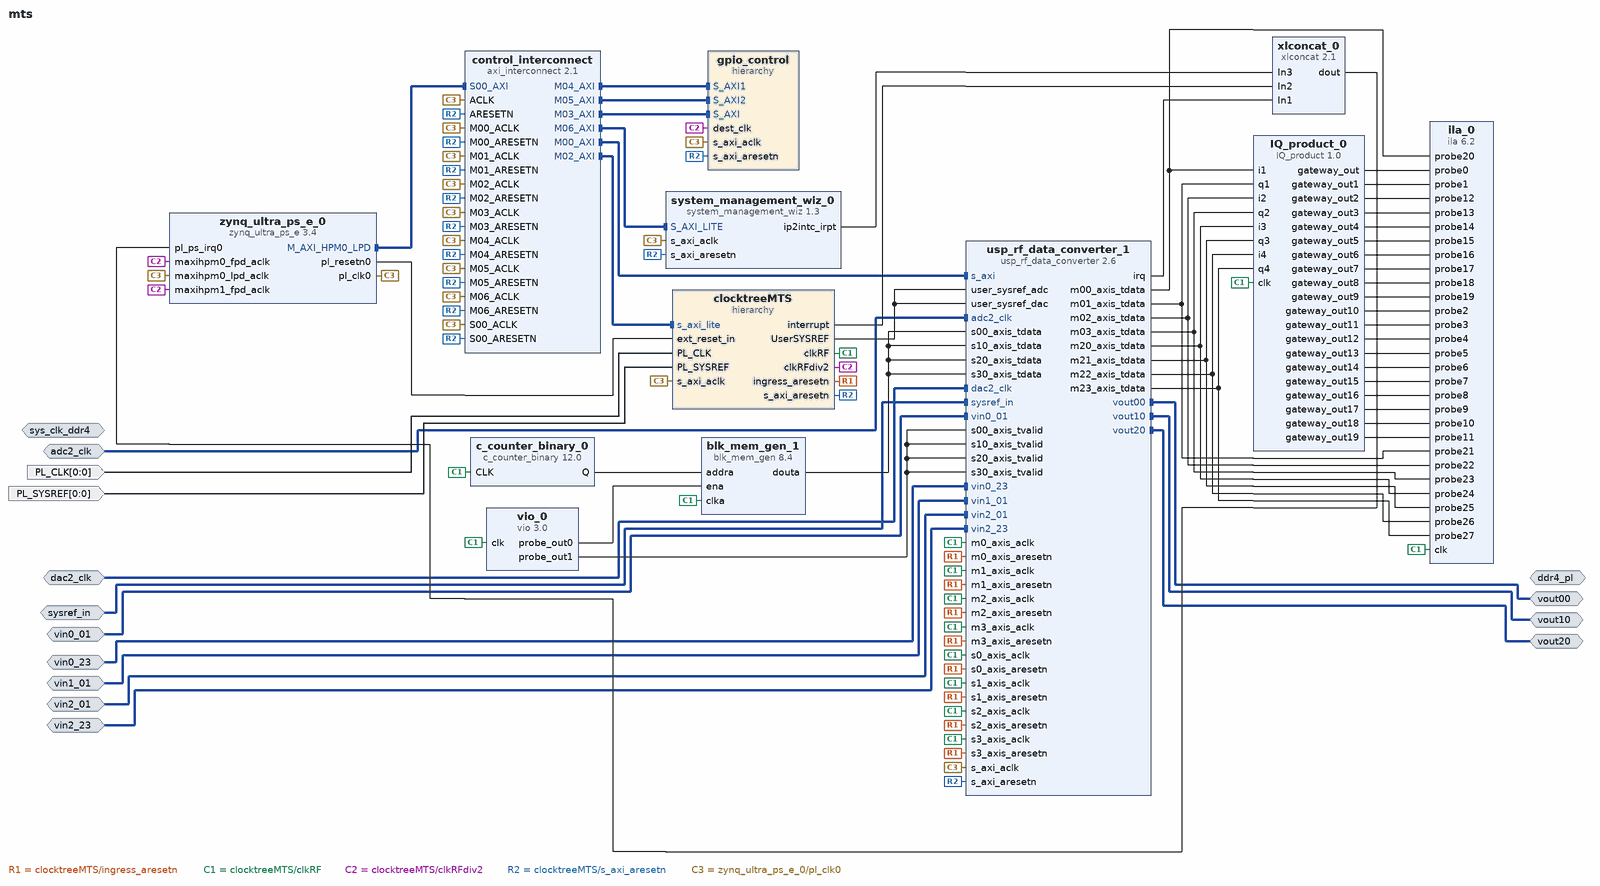
[diagram p0: block diagram of the top level]
# Vivado block design mts, xczu48dr-ffvg1517-2-e, Vivado 2022.2.2
create_bd_design mts

create_bd_intf_port -mode Slave -vlnv xilinx.com:interface:diff_clock_rtl:1.0 adc2_clk
create_bd_intf_port -mode Slave -vlnv xilinx.com:interface:diff_clock_rtl:1.0 dac2_clk
create_bd_intf_port -mode Master -vlnv xilinx.com:interface:ddr4_rtl:1.0 ddr4_pl
create_bd_intf_port -mode Slave -vlnv xilinx.com:interface:diff_clock_rtl:1.0 sys_clk_ddr4
set_property -dict {CONFIG.FREQ_HZ 200000000} [get_bd_intf_ports sys_clk_ddr4]
create_bd_intf_port -mode Slave -vlnv xilinx.com:display_usp_rf_data_converter:diff_pins_rtl:1.0 sysref_in
create_bd_intf_port -mode Slave -vlnv xilinx.com:interface:diff_analog_io_rtl:1.0 vin0_01
create_bd_intf_port -mode Slave -vlnv xilinx.com:interface:diff_analog_io_rtl:1.0 vin0_23
create_bd_intf_port -mode Slave -vlnv xilinx.com:interface:diff_analog_io_rtl:1.0 vin1_01
create_bd_intf_port -mode Slave -vlnv xilinx.com:interface:diff_analog_io_rtl:1.0 vin2_01
create_bd_intf_port -mode Slave -vlnv xilinx.com:interface:diff_analog_io_rtl:1.0 vin2_23
create_bd_intf_port -mode Master -vlnv xilinx.com:interface:diff_analog_io_rtl:1.0 vout00
create_bd_intf_port -mode Master -vlnv xilinx.com:interface:diff_analog_io_rtl:1.0 vout10
create_bd_intf_port -mode Master -vlnv xilinx.com:interface:diff_analog_io_rtl:1.0 vout20
create_bd_port -dir I -from 0 -to 0 -type clk PL_CLK
set_property -dict {CONFIG.FREQ_HZ 500000000} [get_bd_ports PL_CLK]
create_bd_port -dir I -from 0 -to 0 PL_SYSREF

create_bd_cell -type hier clocktreeMTS
create_bd_cell -type ip -vlnv xilinx.com:ip:axi_interconnect:2.1 control_interconnect
set_property -dict [list \
  CONFIG.NUM_MI 7 \
  CONFIG.S00_HAS_DATA_FIFO 0 \
  CONFIG.S00_HAS_REGSLICE 3 \
  CONFIG.STRATEGY 1 \
] [get_bd_cells control_interconnect]
create_bd_cell -type hier gpio_control
create_bd_cell -type ip -vlnv xilinx.com:ip:system_management_wiz:1.3 system_management_wiz_0
set_property -dict [list \
  CONFIG.AVERAGE_ENABLE_TEMPERATURE true \
  CONFIG.AVERAGE_ENABLE_VBRAM true \
  CONFIG.AVERAGE_ENABLE_VCCAUX true \
  CONFIG.AVERAGE_ENABLE_VCCINT true \
  CONFIG.AVERAGE_ENABLE_VCCPSAUX true \
  CONFIG.AVERAGE_ENABLE_VCCPSINTFP true \
  CONFIG.AVERAGE_ENABLE_VCCPSINTLP true \
  CONFIG.CHANNEL_AVERAGING 256 \
  CONFIG.CHANNEL_ENABLE_VCCPSAUX true \
  CONFIG.CHANNEL_ENABLE_VCCPSINTFP true \
  CONFIG.CHANNEL_ENABLE_VCCPSINTLP true \
  CONFIG.CHANNEL_ENABLE_VREFN true \
  CONFIG.CHANNEL_ENABLE_VREFP true \
  CONFIG.ENABLE_VCCPSAUX_ALARM false \
  CONFIG.ENABLE_VCCPSINTFP_ALARM false \
  CONFIG.ENABLE_VCCPSINTLP_ALARM false \
  CONFIG.OT_ALARM false \
  CONFIG.USER_TEMP_ALARM false \
  CONFIG.VCCAUX_ALARM false \
  CONFIG.VCCINT_ALARM false \
] [get_bd_cells system_management_wiz_0]
create_bd_cell -type ip -vlnv xilinx.com:ip:usp_rf_data_converter:2.6 usp_rf_data_converter_1
set_property -dict [list \
  CONFIG.ADC0_Clock_Dist 0 \
  CONFIG.ADC0_Clock_Source 2 \
  CONFIG.ADC0_Multi_Tile_Sync true \
  CONFIG.ADC0_Outclk_Freq 250.000 \
  CONFIG.ADC0_PLL_Enable false \
  CONFIG.ADC0_Refclk_Freq 4000.000 \
  CONFIG.ADC0_Sampling_Rate 4 \
  CONFIG.ADC1_Clock_Dist 0 \
  CONFIG.ADC1_Clock_Source 2 \
  CONFIG.ADC1_Multi_Tile_Sync true \
  CONFIG.ADC1_Outclk_Freq 250.000 \
  CONFIG.ADC1_PLL_Enable false \
  CONFIG.ADC1_Refclk_Freq 4000.000 \
  CONFIG.ADC1_Sampling_Rate 4 \
  CONFIG.ADC2_Clock_Dist 2 \
  CONFIG.ADC2_Clock_Source 2 \
  CONFIG.ADC2_Multi_Tile_Sync true \
  CONFIG.ADC2_Outclk_Freq 250.000 \
  CONFIG.ADC2_PLL_Enable true \
  CONFIG.ADC2_Refclk_Div 1 \
  CONFIG.ADC2_Refclk_Freq 500.000 \
  CONFIG.ADC2_Sampling_Rate 4 \
  CONFIG.ADC3_Clock_Source 2 \
  CONFIG.ADC3_Multi_Tile_Sync true \
  CONFIG.ADC3_Outclk_Freq 250.000 \
  CONFIG.ADC3_PLL_Enable false \
  CONFIG.ADC3_Refclk_Freq 4000.000 \
  CONFIG.ADC3_Sampling_Rate 4 \
  CONFIG.ADC_Data_Type00 1 \
  CONFIG.ADC_Data_Type02 1 \
  CONFIG.ADC_Data_Type10 1 \
  CONFIG.ADC_Data_Type20 1 \
  CONFIG.ADC_Data_Type22 1 \
  CONFIG.ADC_Data_Type30 1 \
  CONFIG.ADC_Data_Width00 1 \
  CONFIG.ADC_Data_Width02 1 \
  CONFIG.ADC_Data_Width10 1 \
  CONFIG.ADC_Data_Width20 1 \
  CONFIG.ADC_Data_Width22 1 \
  CONFIG.ADC_Data_Width30 1 \
  CONFIG.ADC_Decimation_Mode00 40 \
  CONFIG.ADC_Decimation_Mode02 40 \
  CONFIG.ADC_Decimation_Mode10 40 \
  CONFIG.ADC_Decimation_Mode20 40 \
  CONFIG.ADC_Decimation_Mode22 40 \
  CONFIG.ADC_Decimation_Mode30 40 \
  CONFIG.ADC_Dither00 true \
  CONFIG.ADC_Dither10 true \
  CONFIG.ADC_Dither20 true \
  CONFIG.ADC_Dither30 true \
  CONFIG.ADC_Mixer_Type00 2 \
  CONFIG.ADC_Mixer_Type02 2 \
  CONFIG.ADC_Mixer_Type10 2 \
  CONFIG.ADC_Mixer_Type20 2 \
  CONFIG.ADC_Mixer_Type22 2 \
  CONFIG.ADC_Mixer_Type30 2 \
  CONFIG.ADC_NCO_Freq00 4.97 \
  CONFIG.ADC_NCO_Freq02 4.97 \
  CONFIG.ADC_NCO_Freq10 4.97 \
  CONFIG.ADC_NCO_Freq20 4.97 \
  CONFIG.ADC_NCO_Freq22 4.97 \
  CONFIG.ADC_NCO_Freq30 4.97 \
  CONFIG.ADC_OBS02 false \
  CONFIG.ADC_OBS22 false \
  CONFIG.ADC_RTS false \
  CONFIG.ADC_Slice00_Enable true \
  CONFIG.ADC_Slice02_Enable true \
  CONFIG.ADC_Slice10_Enable true \
  CONFIG.ADC_Slice12_Enable false \
  CONFIG.ADC_Slice20_Enable true \
  CONFIG.ADC_Slice22_Enable true \
  CONFIG.ADC_Slice30_Enable true \
  CONFIG.Axiclk_Freq 100.0 \
  CONFIG.DAC0_Clock_Dist 0 \
  CONFIG.DAC0_Clock_Source 6 \
  CONFIG.DAC0_Multi_Tile_Sync true \
  CONFIG.DAC0_Outclk_Freq 39.063 \
  CONFIG.DAC0_PLL_Enable false \
  CONFIG.DAC0_Refclk_Freq 5000.000 \
  CONFIG.DAC0_Sampling_Rate 5 \
  CONFIG.DAC1_Clock_Source 6 \
  CONFIG.DAC1_Multi_Tile_Sync true \
  CONFIG.DAC1_Outclk_Freq 39.063 \
  CONFIG.DAC1_PLL_Enable false \
  CONFIG.DAC1_Refclk_Freq 5000.000 \
  CONFIG.DAC1_Sampling_Rate 5 \
  CONFIG.DAC2_Clock_Dist 2 \
  CONFIG.DAC2_Multi_Tile_Sync true \
  CONFIG.DAC2_Outclk_Freq 39.063 \
  CONFIG.DAC2_PLL_Enable true \
  CONFIG.DAC2_Refclk_Freq 500.000 \
  CONFIG.DAC2_Sampling_Rate 5 \
  CONFIG.DAC3_Clock_Source 6 \
  CONFIG.DAC3_Multi_Tile_Sync true \
  CONFIG.DAC3_Outclk_Freq 39.063 \
  CONFIG.DAC3_PLL_Enable false \
  CONFIG.DAC3_Refclk_Freq 5000.000 \
  CONFIG.DAC3_Sampling_Rate 5 \
  CONFIG.DAC_Coarse_Mixer_Freq00 3 \
  CONFIG.DAC_Coarse_Mixer_Freq10 3 \
  CONFIG.DAC_Coarse_Mixer_Freq20 3 \
  CONFIG.DAC_Coarse_Mixer_Freq30 3 \
  CONFIG.DAC_Data_Type30 0 \
  CONFIG.DAC_Data_Width00 1 \
  CONFIG.DAC_Data_Width10 1 \
  CONFIG.DAC_Data_Width20 1 \
  CONFIG.DAC_Data_Width30 1 \
  CONFIG.DAC_Interpolation_Mode00 40 \
  CONFIG.DAC_Interpolation_Mode10 40 \
  CONFIG.DAC_Interpolation_Mode20 40 \
  CONFIG.DAC_Interpolation_Mode30 40 \
  CONFIG.DAC_Mixer_Type00 1 \
  CONFIG.DAC_Mixer_Type10 1 \
  CONFIG.DAC_Mixer_Type20 1 \
  CONFIG.DAC_Mixer_Type30 1 \
  CONFIG.DAC_Mode00 1 \
  CONFIG.DAC_Mode10 1 \
  CONFIG.DAC_Mode20 1 \
  CONFIG.DAC_Mode30 1 \
  CONFIG.DAC_Output_Current 0 \
  CONFIG.DAC_Slice00_Enable true \
  CONFIG.DAC_Slice02_Enable false \
  CONFIG.DAC_Slice10_Enable true \
  CONFIG.DAC_Slice12_Enable false \
  CONFIG.DAC_Slice20_Enable true \
  CONFIG.DAC_Slice22_Enable false \
  CONFIG.DAC_Slice30_Enable true \
  CONFIG.DAC_Slice32_Enable false \
  CONFIG.DAC_VOP_Mode 0 \
  CONFIG.RF_Analyzer 0 \
] [get_bd_cells usp_rf_data_converter_1]
create_bd_cell -type ip -vlnv xilinx.com:ip:xlconcat:2.1 xlconcat_0
set_property -dict {CONFIG.NUM_PORTS 4} [get_bd_cells xlconcat_0]
create_bd_cell -type ip -vlnv xilinx.com:ip:zynq_ultra_ps_e:3.4 zynq_ultra_ps_e_0
set_property -dict [list \
  CONFIG.CAN0_BOARD_INTERFACE custom \
  CONFIG.CAN1_BOARD_INTERFACE custom \
  CONFIG.CSU_BOARD_INTERFACE custom \
  CONFIG.DP_BOARD_INTERFACE custom \
  CONFIG.GEM0_BOARD_INTERFACE custom \
  CONFIG.GEM1_BOARD_INTERFACE custom \
  CONFIG.GEM2_BOARD_INTERFACE custom \
  CONFIG.GEM3_BOARD_INTERFACE custom \
  CONFIG.GPIO_BOARD_INTERFACE custom \
  CONFIG.IIC0_BOARD_INTERFACE custom \
  CONFIG.IIC1_BOARD_INTERFACE custom \
  CONFIG.NAND_BOARD_INTERFACE custom \
  CONFIG.PCIE_BOARD_INTERFACE custom \
  CONFIG.PJTAG_BOARD_INTERFACE custom \
  CONFIG.PMU_BOARD_INTERFACE custom \
  CONFIG.PSU_BANK_0_IO_STANDARD LVCMOS18 \
  CONFIG.PSU_BANK_1_IO_STANDARD LVCMOS18 \
  CONFIG.PSU_BANK_2_IO_STANDARD LVCMOS18 \
  CONFIG.PSU_BANK_3_IO_STANDARD LVCMOS33 \
  CONFIG.PSU_USB3__DUAL_CLOCK_ENABLE 1 \
  CONFIG.PSU__CAN1__PERIPHERAL__ENABLE 0 \
  CONFIG.PSU__CRF_APB__ACPU_CTRL__FREQMHZ 1200 \
  CONFIG.PSU__CRF_APB__ACPU_CTRL__SRCSEL APLL \
  CONFIG.PSU__CRF_APB__APLL_CTRL__SRCSEL PSS_REF_CLK \
  CONFIG.PSU__CRF_APB__DBG_FPD_CTRL__FREQMHZ 250 \
  CONFIG.PSU__CRF_APB__DBG_FPD_CTRL__SRCSEL IOPLL \
  CONFIG.PSU__CRF_APB__DBG_TRACE_CTRL__FREQMHZ 250 \
  CONFIG.PSU__CRF_APB__DBG_TRACE_CTRL__SRCSEL IOPLL \
  CONFIG.PSU__CRF_APB__DBG_TSTMP_CTRL__FREQMHZ 250 \
  CONFIG.PSU__CRF_APB__DBG_TSTMP_CTRL__SRCSEL IOPLL \
  CONFIG.PSU__CRF_APB__DDR_CTRL__FREQMHZ 1067 \
  CONFIG.PSU__CRF_APB__DDR_CTRL__SRCSEL DPLL \
  CONFIG.PSU__CRF_APB__DPDMA_REF_CTRL__FREQMHZ 600 \
  CONFIG.PSU__CRF_APB__DPDMA_REF_CTRL__SRCSEL APLL \
  CONFIG.PSU__CRF_APB__DPLL_CTRL__SRCSEL PSS_REF_CLK \
  CONFIG.PSU__CRF_APB__DP_AUDIO_REF_CTRL__SRCSEL RPLL \
  CONFIG.PSU__CRF_APB__DP_STC_REF_CTRL__SRCSEL RPLL \
  CONFIG.PSU__CRF_APB__DP_VIDEO_REF_CTRL__SRCSEL VPLL \
  CONFIG.PSU__CRF_APB__GDMA_REF_CTRL__FREQMHZ 600 \
  CONFIG.PSU__CRF_APB__GDMA_REF_CTRL__SRCSEL APLL \
  CONFIG.PSU__CRF_APB__GPU_REF_CTRL__FREQMHZ 500 \
  CONFIG.PSU__CRF_APB__GPU_REF_CTRL__SRCSEL IOPLL \
  CONFIG.PSU__CRF_APB__TOPSW_LSBUS_CTRL__FREQMHZ 100 \
  CONFIG.PSU__CRF_APB__TOPSW_LSBUS_CTRL__SRCSEL IOPLL \
  CONFIG.PSU__CRF_APB__TOPSW_MAIN_CTRL__FREQMHZ 533.33 \
  CONFIG.PSU__CRF_APB__TOPSW_MAIN_CTRL__SRCSEL DPLL \
  CONFIG.PSU__CRF_APB__VPLL_CTRL__SRCSEL PSS_REF_CLK \
  CONFIG.PSU__CRL_APB__ADMA_REF_CTRL__FREQMHZ 500 \
  CONFIG.PSU__CRL_APB__ADMA_REF_CTRL__SRCSEL IOPLL \
  CONFIG.PSU__CRL_APB__CAN1_REF_CTRL__FREQMHZ 100 \
  CONFIG.PSU__CRL_APB__CAN1_REF_CTRL__SRCSEL IOPLL \
  CONFIG.PSU__CRL_APB__CPU_R5_CTRL__FREQMHZ 500 \
  CONFIG.PSU__CRL_APB__CPU_R5_CTRL__SRCSEL IOPLL \
  CONFIG.PSU__CRL_APB__DBG_LPD_CTRL__FREQMHZ 250 \
  CONFIG.PSU__CRL_APB__DBG_LPD_CTRL__SRCSEL IOPLL \
  CONFIG.PSU__CRL_APB__GEM3_REF_CTRL__FREQMHZ 125 \
  CONFIG.PSU__CRL_APB__GEM3_REF_CTRL__SRCSEL IOPLL \
  CONFIG.PSU__CRL_APB__I2C0_REF_CTRL__FREQMHZ 100 \
  CONFIG.PSU__CRL_APB__I2C0_REF_CTRL__SRCSEL IOPLL \
  CONFIG.PSU__CRL_APB__I2C1_REF_CTRL__FREQMHZ 100 \
  CONFIG.PSU__CRL_APB__I2C1_REF_CTRL__SRCSEL IOPLL \
  CONFIG.PSU__CRL_APB__IOPLL_CTRL__SRCSEL PSS_REF_CLK \
  CONFIG.PSU__CRL_APB__IOU_SWITCH_CTRL__FREQMHZ 250 \
  CONFIG.PSU__CRL_APB__IOU_SWITCH_CTRL__SRCSEL IOPLL \
  CONFIG.PSU__CRL_APB__LPD_LSBUS_CTRL__FREQMHZ 100 \
  CONFIG.PSU__CRL_APB__LPD_LSBUS_CTRL__SRCSEL IOPLL \
  CONFIG.PSU__CRL_APB__LPD_SWITCH_CTRL__FREQMHZ 500 \
  CONFIG.PSU__CRL_APB__LPD_SWITCH_CTRL__SRCSEL IOPLL \
  CONFIG.PSU__CRL_APB__PCAP_CTRL__FREQMHZ 200 \
  CONFIG.PSU__CRL_APB__PCAP_CTRL__SRCSEL IOPLL \
  CONFIG.PSU__CRL_APB__PL0_REF_CTRL__FREQMHZ 100 \
  CONFIG.PSU__CRL_APB__PL0_REF_CTRL__SRCSEL IOPLL \
  CONFIG.PSU__CRL_APB__QSPI_REF_CTRL__FREQMHZ 125 \
  CONFIG.PSU__CRL_APB__QSPI_REF_CTRL__SRCSEL IOPLL \
  CONFIG.PSU__CRL_APB__RPLL_CTRL__SRCSEL PSS_REF_CLK \
  CONFIG.PSU__CRL_APB__SDIO1_REF_CTRL__FREQMHZ 200 \
  CONFIG.PSU__CRL_APB__SDIO1_REF_CTRL__SRCSEL IOPLL \
  CONFIG.PSU__CRL_APB__TIMESTAMP_REF_CTRL__FREQMHZ 100 \
  CONFIG.PSU__CRL_APB__TIMESTAMP_REF_CTRL__SRCSEL IOPLL \
  CONFIG.PSU__CRL_APB__UART0_REF_CTRL__FREQMHZ 100 \
  CONFIG.PSU__CRL_APB__UART0_REF_CTRL__SRCSEL IOPLL \
  CONFIG.PSU__CRL_APB__UART1_REF_CTRL__FREQMHZ 100 \
  CONFIG.PSU__CRL_APB__UART1_REF_CTRL__SRCSEL IOPLL \
  CONFIG.PSU__CRL_APB__USB0_BUS_REF_CTRL__FREQMHZ 250 \
  CONFIG.PSU__CRL_APB__USB0_BUS_REF_CTRL__SRCSEL IOPLL \
  CONFIG.PSU__CRL_APB__USB3_DUAL_REF_CTRL__FREQMHZ 20 \
  CONFIG.PSU__CRL_APB__USB3_DUAL_REF_CTRL__SRCSEL IOPLL \
  CONFIG.PSU__CRL_APB__USB3__ENABLE 1 \
  CONFIG.PSU__CSUPMU__PERIPHERAL__VALID 1 \
  CONFIG.PSU__DDRC__BUS_WIDTH {64 Bit} \
  CONFIG.PSU__DDRC__COMPONENTS UDIMM \
  CONFIG.PSU__DDRC__DEVICE_CAPACITY {8192 MBits} \
  CONFIG.PSU__DDRC__DRAM_WIDTH {16 Bits} \
  CONFIG.PSU__DDRC__ECC Disabled \
  CONFIG.PSU__DDRC__MEMORY_TYPE {DDR 4} \
  CONFIG.PSU__DDRC__SPEED_BIN DDR4_2133P \
  CONFIG.PSU__DDR_HIGH_ADDRESS_GUI_ENABLE 1 \
  CONFIG.PSU__DDR__INTERFACE__FREQMHZ 533.500 \
  CONFIG.PSU__DEVICE_TYPE RFSOC \
  CONFIG.PSU__DISPLAYPORT__LANE0__ENABLE 1 \
  CONFIG.PSU__DISPLAYPORT__LANE0__IO {GT Lane1} \
  CONFIG.PSU__DISPLAYPORT__LANE1__ENABLE 1 \
  CONFIG.PSU__DISPLAYPORT__LANE1__IO {GT Lane0} \
  CONFIG.PSU__DISPLAYPORT__PERIPHERAL__ENABLE 1 \
  CONFIG.PSU__DLL__ISUSED 1 \
  CONFIG.PSU__DPAUX__PERIPHERAL__ENABLE 1 \
  CONFIG.PSU__DPAUX__PERIPHERAL__IO {MIO 27 .. 30} \
  CONFIG.PSU__DP__LANE_SEL {Dual Lower} \
  CONFIG.PSU__DP__REF_CLK_FREQ 27 \
  CONFIG.PSU__DP__REF_CLK_SEL {Ref Clk1} \
  CONFIG.PSU__ENET3__FIFO__ENABLE 0 \
  CONFIG.PSU__ENET3__GRP_MDIO__ENABLE 1 \
  CONFIG.PSU__ENET3__GRP_MDIO__IO {MIO 76 .. 77} \
  CONFIG.PSU__ENET3__PERIPHERAL__ENABLE 1 \
  CONFIG.PSU__ENET3__PERIPHERAL__IO {MIO 64 .. 75} \
  CONFIG.PSU__ENET3__PTP__ENABLE 0 \
  CONFIG.PSU__ENET3__TSU__ENABLE 0 \
  CONFIG.PSU__FPGA_PL0_ENABLE 1 \
  CONFIG.PSU__GEM3_COHERENCY 0 \
  CONFIG.PSU__GEM3_ROUTE_THROUGH_FPD 0 \
  CONFIG.PSU__GEM__TSU__ENABLE 0 \
  CONFIG.PSU__GPIO0_MIO__IO {MIO 0 .. 25} \
  CONFIG.PSU__GPIO0_MIO__PERIPHERAL__ENABLE 1 \
  CONFIG.PSU__GPIO1_MIO__IO {MIO 26 .. 51} \
  CONFIG.PSU__GPIO1_MIO__PERIPHERAL__ENABLE 1 \
  CONFIG.PSU__GPU_PP0__POWER__ON 0 \
  CONFIG.PSU__GPU_PP1__POWER__ON 0 \
  CONFIG.PSU__GT__LINK_SPEED HBR \
  CONFIG.PSU__GT__PRE_EMPH_LVL_4 0 \
  CONFIG.PSU__GT__VLT_SWNG_LVL_4 0 \
  CONFIG.PSU__I2C0__PERIPHERAL__ENABLE 1 \
  CONFIG.PSU__I2C0__PERIPHERAL__IO {MIO 14 .. 15} \
  CONFIG.PSU__I2C1__PERIPHERAL__ENABLE 1 \
  CONFIG.PSU__I2C1__PERIPHERAL__IO {MIO 16 .. 17} \
  CONFIG.PSU__IOU_SLCR__IOU_TTC_APB_CLK__TTC0_SEL APB \
  CONFIG.PSU__IOU_SLCR__IOU_TTC_APB_CLK__TTC1_SEL APB \
  CONFIG.PSU__IOU_SLCR__IOU_TTC_APB_CLK__TTC2_SEL APB \
  CONFIG.PSU__IOU_SLCR__IOU_TTC_APB_CLK__TTC3_SEL APB \
  CONFIG.PSU__MAXIGP0__DATA_WIDTH 128 \
  CONFIG.PSU__OVERRIDE_HPX_QOS 0 \
  CONFIG.PSU__OVERRIDE__BASIC_CLOCK 0 \
  CONFIG.PSU__PMU_COHERENCY 0 \
  CONFIG.PSU__PMU__AIBACK__ENABLE 0 \
  CONFIG.PSU__PMU__EMIO_GPI__ENABLE 0 \
  CONFIG.PSU__PMU__EMIO_GPO__ENABLE 0 \
  CONFIG.PSU__PMU__GPI0__ENABLE 0 \
  CONFIG.PSU__PMU__GPI1__ENABLE 0 \
  CONFIG.PSU__PMU__GPI2__ENABLE 0 \
  CONFIG.PSU__PMU__GPI3__ENABLE 0 \
  CONFIG.PSU__PMU__GPI4__ENABLE 0 \
  CONFIG.PSU__PMU__GPI5__ENABLE 0 \
  CONFIG.PSU__PMU__GPO0__ENABLE 1 \
  CONFIG.PSU__PMU__GPO0__IO {MIO 32} \
  CONFIG.PSU__PMU__GPO1__ENABLE 1 \
  CONFIG.PSU__PMU__GPO1__IO {MIO 33} \
  CONFIG.PSU__PMU__GPO2__ENABLE 1 \
  CONFIG.PSU__PMU__GPO2__IO {MIO 34} \
  CONFIG.PSU__PMU__GPO2__POLARITY low \
  CONFIG.PSU__PMU__GPO3__ENABLE 1 \
  CONFIG.PSU__PMU__GPO3__IO {MIO 35} \
  CONFIG.PSU__PMU__GPO3__POLARITY low \
  CONFIG.PSU__PMU__GPO4__ENABLE 1 \
  CONFIG.PSU__PMU__GPO4__IO {MIO 36} \
  CONFIG.PSU__PMU__GPO4__POLARITY low \
  CONFIG.PSU__PMU__GPO5__ENABLE 1 \
  CONFIG.PSU__PMU__GPO5__IO {MIO 37} \
  CONFIG.PSU__PMU__GPO5__POLARITY low \
  CONFIG.PSU__PMU__PERIPHERAL__ENABLE 1 \
  CONFIG.PSU__PMU__PLERROR__ENABLE 0 \
  CONFIG.PSU__PRESET_APPLIED 1 \
  CONFIG.PSU__PSS_REF_CLK__FREQMHZ 33.33333333333333333333333333333333333333333333333333 \
  CONFIG.PSU__QSPI_COHERENCY 0 \
  CONFIG.PSU__QSPI_ROUTE_THROUGH_FPD 0 \
  CONFIG.PSU__QSPI__GRP_FBCLK__ENABLE 1 \
  CONFIG.PSU__QSPI__GRP_FBCLK__IO {MIO 6} \
  CONFIG.PSU__QSPI__PERIPHERAL__DATA_MODE x4 \
  CONFIG.PSU__QSPI__PERIPHERAL__ENABLE 1 \
  CONFIG.PSU__QSPI__PERIPHERAL__IO {MIO 0 .. 12} \
  CONFIG.PSU__QSPI__PERIPHERAL__MODE {Dual Parallel} \
  CONFIG.PSU__SATA__LANE1__IO {GT Lane3} \
  CONFIG.PSU__SATA__PERIPHERAL__ENABLE 1 \
  CONFIG.PSU__SATA__REF_CLK_FREQ 125 \
  CONFIG.PSU__SATA__REF_CLK_SEL {Ref Clk3} \
  CONFIG.PSU__SD0__CLK_100_SDR_OTAP_DLY 0x3 \
  CONFIG.PSU__SD0__CLK_200_SDR_OTAP_DLY 0x3 \
  CONFIG.PSU__SD0__CLK_50_DDR_ITAP_DLY 0x3D \
  CONFIG.PSU__SD0__CLK_50_DDR_OTAP_DLY 0x4 \
  CONFIG.PSU__SD0__CLK_50_SDR_ITAP_DLY 0x15 \
  CONFIG.PSU__SD0__CLK_50_SDR_OTAP_DLY 0x5 \
  CONFIG.PSU__SD1_COHERENCY 0 \
  CONFIG.PSU__SD1_ROUTE_THROUGH_FPD 0 \
  CONFIG.PSU__SD1__CLK_100_SDR_OTAP_DLY 0x3 \
  CONFIG.PSU__SD1__CLK_200_SDR_OTAP_DLY 0x3 \
  CONFIG.PSU__SD1__CLK_50_DDR_ITAP_DLY 0x3D \
  CONFIG.PSU__SD1__CLK_50_DDR_OTAP_DLY 0x4 \
  CONFIG.PSU__SD1__CLK_50_SDR_ITAP_DLY 0x15 \
  CONFIG.PSU__SD1__CLK_50_SDR_OTAP_DLY 0x5 \
  CONFIG.PSU__SD1__DATA_TRANSFER_MODE 8Bit \
  CONFIG.PSU__SD1__GRP_CD__ENABLE 1 \
  CONFIG.PSU__SD1__GRP_CD__IO {MIO 45} \
  CONFIG.PSU__SD1__GRP_POW__ENABLE 0 \
  CONFIG.PSU__SD1__GRP_WP__ENABLE 0 \
  CONFIG.PSU__SD1__PERIPHERAL__ENABLE 1 \
  CONFIG.PSU__SD1__PERIPHERAL__IO {MIO 39 .. 51} \
  CONFIG.PSU__SD1__SLOT_TYPE {SD 3.0} \
  CONFIG.PSU__SWDT0__CLOCK__ENABLE 0 \
  CONFIG.PSU__SWDT0__PERIPHERAL__ENABLE 1 \
  CONFIG.PSU__SWDT0__RESET__ENABLE 0 \
  CONFIG.PSU__SWDT1__CLOCK__ENABLE 0 \
  CONFIG.PSU__SWDT1__PERIPHERAL__ENABLE 1 \
  CONFIG.PSU__SWDT1__RESET__ENABLE 0 \
  CONFIG.PSU__TSU__BUFG_PORT_PAIR 0 \
  CONFIG.PSU__TTC0__CLOCK__ENABLE 0 \
  CONFIG.PSU__TTC0__PERIPHERAL__ENABLE 1 \
  CONFIG.PSU__TTC0__WAVEOUT__ENABLE 0 \
  CONFIG.PSU__TTC1__CLOCK__ENABLE 0 \
  CONFIG.PSU__TTC1__PERIPHERAL__ENABLE 1 \
  CONFIG.PSU__TTC1__WAVEOUT__ENABLE 0 \
  CONFIG.PSU__TTC2__CLOCK__ENABLE 0 \
  CONFIG.PSU__TTC2__PERIPHERAL__ENABLE 1 \
  CONFIG.PSU__TTC2__WAVEOUT__ENABLE 0 \
  CONFIG.PSU__TTC3__CLOCK__ENABLE 0 \
  CONFIG.PSU__TTC3__PERIPHERAL__ENABLE 1 \
  CONFIG.PSU__TTC3__WAVEOUT__ENABLE 0 \
  CONFIG.PSU__UART0__BAUD_RATE 115200 \
  CONFIG.PSU__UART0__MODEM__ENABLE 0 \
  CONFIG.PSU__UART0__PERIPHERAL__ENABLE 1 \
  CONFIG.PSU__UART0__PERIPHERAL__IO {MIO 18 .. 19} \
  CONFIG.PSU__UART1__PERIPHERAL__ENABLE 0 \
  CONFIG.PSU__USB0_COHERENCY 0 \
  CONFIG.PSU__USB0__PERIPHERAL__ENABLE 1 \
  CONFIG.PSU__USB0__PERIPHERAL__IO {MIO 52 .. 63} \
  CONFIG.PSU__USB0__REF_CLK_FREQ 26 \
  CONFIG.PSU__USB0__REF_CLK_SEL {Ref Clk2} \
  CONFIG.PSU__USB2_0__EMIO__ENABLE 0 \
  CONFIG.PSU__USB3_0__EMIO__ENABLE 0 \
  CONFIG.PSU__USB3_0__PERIPHERAL__ENABLE 1 \
  CONFIG.PSU__USB3_0__PERIPHERAL__IO {GT Lane2} \
  CONFIG.PSU__USB__RESET__MODE {Boot Pin} \
  CONFIG.PSU__USB__RESET__POLARITY {Active Low} \
  CONFIG.PSU__USE__IRQ0 1 \
  CONFIG.PSU__USE__M_AXI_GP0 1 \
  CONFIG.PSU__USE__M_AXI_GP1 1 \
  CONFIG.PSU__USE__M_AXI_GP2 1 \
  CONFIG.QSPI_BOARD_INTERFACE custom \
  CONFIG.SATA_BOARD_INTERFACE custom \
  CONFIG.SD0_BOARD_INTERFACE custom \
  CONFIG.SD1_BOARD_INTERFACE custom \
  CONFIG.SPI0_BOARD_INTERFACE custom \
  CONFIG.SPI1_BOARD_INTERFACE custom \
  CONFIG.SUBPRESET1 Custom \
  CONFIG.SUBPRESET2 Custom \
  CONFIG.SWDT0_BOARD_INTERFACE custom \
  CONFIG.SWDT1_BOARD_INTERFACE custom \
  CONFIG.TRACE_BOARD_INTERFACE custom \
  CONFIG.TTC0_BOARD_INTERFACE custom \
  CONFIG.TTC1_BOARD_INTERFACE custom \
  CONFIG.TTC2_BOARD_INTERFACE custom \
  CONFIG.TTC3_BOARD_INTERFACE custom \
  CONFIG.UART0_BOARD_INTERFACE custom \
  CONFIG.UART1_BOARD_INTERFACE custom \
  CONFIG.USB0_BOARD_INTERFACE custom \
  CONFIG.USB1_BOARD_INTERFACE custom \
] [get_bd_cells zynq_ultra_ps_e_0]
# 736 more settings of zynq_ultra_ps_e_0 are not shown: defaults, MIO pin electricals, DDR timing, and values the tool derives
create_bd_cell -type ip -vlnv Technion:VMC:IQ_product:1.0 IQ_product_0
create_bd_cell -type ip -vlnv xilinx.com:ip:ila:6.2 ila_0
set_property -dict [list \
  CONFIG.C_DATA_DEPTH 8192 \
  CONFIG.C_INPUT_PIPE_STAGES 6 \
  CONFIG.C_MONITOR_TYPE Native \
  CONFIG.C_NUM_OF_PROBES 28 \
  CONFIG.C_PROBE0_TYPE 1 \
  CONFIG.C_PROBE0_WIDTH 33 \
  CONFIG.C_PROBE10_TYPE 1 \
  CONFIG.C_PROBE10_WIDTH 33 \
  CONFIG.C_PROBE11_TYPE 1 \
  CONFIG.C_PROBE11_WIDTH 33 \
  CONFIG.C_PROBE12_TYPE 1 \
  CONFIG.C_PROBE12_WIDTH 33 \
  CONFIG.C_PROBE13_TYPE 1 \
  CONFIG.C_PROBE13_WIDTH 33 \
  CONFIG.C_PROBE14_TYPE 1 \
  CONFIG.C_PROBE14_WIDTH 33 \
  CONFIG.C_PROBE15_TYPE 1 \
  CONFIG.C_PROBE15_WIDTH 33 \
  CONFIG.C_PROBE16_TYPE 1 \
  CONFIG.C_PROBE16_WIDTH 33 \
  CONFIG.C_PROBE17_TYPE 1 \
  CONFIG.C_PROBE17_WIDTH 33 \
  CONFIG.C_PROBE18_TYPE 1 \
  CONFIG.C_PROBE18_WIDTH 33 \
  CONFIG.C_PROBE19_TYPE 1 \
  CONFIG.C_PROBE19_WIDTH 33 \
  CONFIG.C_PROBE1_TYPE 1 \
  CONFIG.C_PROBE1_WIDTH 33 \
  CONFIG.C_PROBE20_WIDTH 16 \
  CONFIG.C_PROBE21_WIDTH 16 \
  CONFIG.C_PROBE22_WIDTH 16 \
  CONFIG.C_PROBE23_WIDTH 16 \
  CONFIG.C_PROBE24_WIDTH 16 \
  CONFIG.C_PROBE25_WIDTH 16 \
  CONFIG.C_PROBE26_WIDTH 16 \
  CONFIG.C_PROBE27_WIDTH 16 \
  CONFIG.C_PROBE2_TYPE 1 \
  CONFIG.C_PROBE2_WIDTH 33 \
  CONFIG.C_PROBE3_TYPE 1 \
  CONFIG.C_PROBE3_WIDTH 33 \
  CONFIG.C_PROBE4_TYPE 1 \
  CONFIG.C_PROBE4_WIDTH 33 \
  CONFIG.C_PROBE5_TYPE 1 \
  CONFIG.C_PROBE5_WIDTH 33 \
  CONFIG.C_PROBE6_TYPE 1 \
  CONFIG.C_PROBE6_WIDTH 33 \
  CONFIG.C_PROBE7_TYPE 1 \
  CONFIG.C_PROBE7_WIDTH 33 \
  CONFIG.C_PROBE8_TYPE 1 \
  CONFIG.C_PROBE8_WIDTH 33 \
  CONFIG.C_PROBE9_TYPE 1 \
  CONFIG.C_PROBE9_WIDTH 33 \
] [get_bd_cells ila_0]
create_bd_cell -type ip -vlnv xilinx.com:ip:c_counter_binary:12.0 c_counter_binary_0
set_property -dict {CONFIG.Output_Width 14} [get_bd_cells c_counter_binary_0]
create_bd_cell -type ip -vlnv xilinx.com:ip:blk_mem_gen:8.4 blk_mem_gen_1
set_property -dict [list \
  CONFIG.Coe_File ../../../../../../../../../../../../../Users/sega-/OneDrive/Desktop/ofdm_20_5g_16384_int16.coe \
  CONFIG.Fill_Remaining_Memory_Locations false \
  CONFIG.Load_Init_File true \
  CONFIG.Operating_Mode_A NO_CHANGE \
  CONFIG.PRIM_type_to_Implement BRAM \
  CONFIG.Read_Width_A 16 \
  CONFIG.Register_PortA_Output_of_Memory_Core false \
  CONFIG.Use_Byte_Write_Enable false \
  CONFIG.Write_Depth_A 16384 \
  CONFIG.Write_Width_A 16 \
  CONFIG.use_bram_block Stand_Alone \
] [get_bd_cells blk_mem_gen_1]
create_bd_cell -type ip -vlnv xilinx.com:ip:vio:3.0 vio_0
set_property -dict {CONFIG.C_NUM_PROBE_IN 0 CONFIG.C_NUM_PROBE_OUT 3} [get_bd_cells vio_0]

# ---- hierarchy /clocktreeMTS ----
current_bd_instance /clocktreeMTS
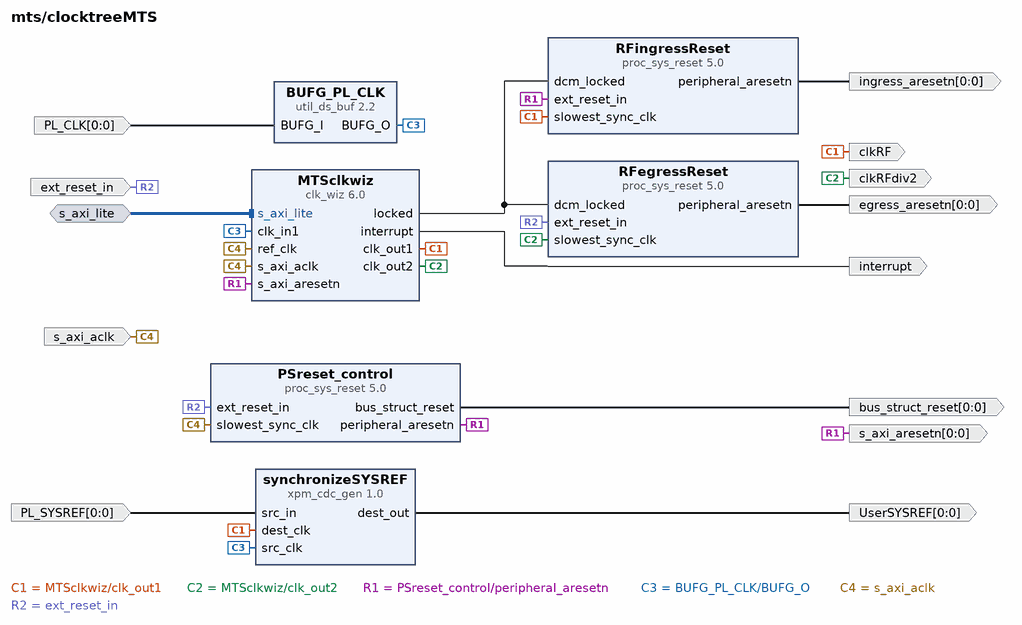
[diagram p1: block diagram inside /clocktreeMTS]
create_bd_intf_pin -mode Slave -vlnv xilinx.com:interface:aximm_rtl:1.0 s_axi_lite
create_bd_pin -dir I -from 0 -to 0 -type clk PL_CLK
create_bd_pin -dir I -from 0 -to 0 PL_SYSREF
create_bd_pin -dir O -from 0 -to 0 UserSYSREF
create_bd_pin -dir O -from 0 -to 0 -type rst bus_struct_reset
create_bd_pin -dir O -type clk clkRF
create_bd_pin -dir O -type clk clkRFdiv2
create_bd_pin -dir O -from 0 -to 0 -type rst egress_aresetn
create_bd_pin -dir I -type rst ext_reset_in
create_bd_pin -dir O -from 0 -to 0 -type rst ingress_aresetn
create_bd_pin -dir O -type intr interrupt
create_bd_pin -dir I -type clk s_axi_aclk
create_bd_pin -dir O -from 0 -to 0 -type rst s_axi_aresetn

create_bd_cell -type ip -vlnv xilinx.com:ip:util_ds_buf:2.2 BUFG_PL_CLK
set_property -dict {CONFIG.C_BUF_TYPE BUFG} [get_bd_cells BUFG_PL_CLK]
create_bd_cell -type ip -vlnv xilinx.com:ip:clk_wiz:6.0 MTSclkwiz
set_property -dict [list \
  CONFIG.AUTO_PRIMITIVE MMCM \
  CONFIG.CLKIN1_JITTER_PS 0.10 \
  CONFIG.CLKIN1_UI_JITTER 0.10 \
  CONFIG.CLKIN2_JITTER_PS 100.000 \
  CONFIG.CLKIN2_UI_JITTER 100.000 \
  CONFIG.CLKOUT1_DRIVES Buffer \
  CONFIG.CLKOUT1_JITTER 68.289 \
  CONFIG.CLKOUT1_MATCHED_ROUTING true \
  CONFIG.CLKOUT1_PHASE_ERROR 66.020 \
  CONFIG.CLKOUT1_REQUESTED_OUT_FREQ 500.0 \
  CONFIG.CLKOUT2_DRIVES Buffer \
  CONFIG.CLKOUT2_JITTER 78.335 \
  CONFIG.CLKOUT2_MATCHED_ROUTING true \
  CONFIG.CLKOUT2_PHASE_ERROR 66.020 \
  CONFIG.CLKOUT2_REQUESTED_OUT_FREQ 250.0 \
  CONFIG.CLKOUT2_USED true \
  CONFIG.CLKOUT3_DRIVES Buffer \
  CONFIG.CLKOUT4_DRIVES Buffer \
  CONFIG.CLKOUT5_DRIVES Buffer \
  CONFIG.CLKOUT6_DRIVES Buffer \
  CONFIG.CLKOUT7_DRIVES Buffer \
  CONFIG.ENABLE_CLOCK_MONITOR true \
  CONFIG.FEEDBACK_SOURCE FDBK_AUTO \
  CONFIG.JITTER_OPTIONS PS \
  CONFIG.JITTER_SEL Min_O_Jitter \
  CONFIG.MMCM_BANDWIDTH HIGH \
  CONFIG.MMCM_CLKFBOUT_MULT_F 3.000 \
  CONFIG.MMCM_CLKIN1_PERIOD 2.000 \
  CONFIG.MMCM_CLKIN2_PERIOD 10.0 \
  CONFIG.MMCM_CLKOUT0_DIVIDE_F 3.000 \
  CONFIG.MMCM_CLKOUT1_DIVIDE 6 \
  CONFIG.MMCM_COMPENSATION AUTO \
  CONFIG.MMCM_DIVCLK_DIVIDE 1 \
  CONFIG.MMCM_REF_JITTER1 0.000 \
  CONFIG.MMCM_REF_JITTER2 0.010 \
  CONFIG.NUM_OUT_CLKS 2 \
  CONFIG.OPTIMIZE_CLOCKING_STRUCTURE_EN false \
  CONFIG.PRIMITIVE MMCM \
  CONFIG.PRIM_IN_FREQ 500.0 \
  CONFIG.PRIM_SOURCE Global_buffer \
  CONFIG.SECONDARY_SOURCE Single_ended_clock_capable_pin \
  CONFIG.USE_LOCKED true \
  CONFIG.USE_PHASE_ALIGNMENT true \
  CONFIG.USE_RESET true \
] [get_bd_cells MTSclkwiz]
create_bd_cell -type ip -vlnv xilinx.com:ip:proc_sys_reset:5.0 PSreset_control
create_bd_cell -type ip -vlnv xilinx.com:ip:proc_sys_reset:5.0 RFegressReset
create_bd_cell -type ip -vlnv xilinx.com:ip:proc_sys_reset:5.0 RFingressReset
create_bd_cell -type ip -vlnv xilinx.com:ip:xpm_cdc_gen:1.0 synchronizeSYSREF
set_property -dict [list \
  CONFIG.CDC_TYPE xpm_cdc_single \
  CONFIG.DEST_SYNC_FF 2 \
  CONFIG.INIT_SYNC_FF true \
  CONFIG.WIDTH 1 \
] [get_bd_cells synchronizeSYSREF]

# ---- hierarchy /gpio_control ----
current_bd_instance /gpio_control
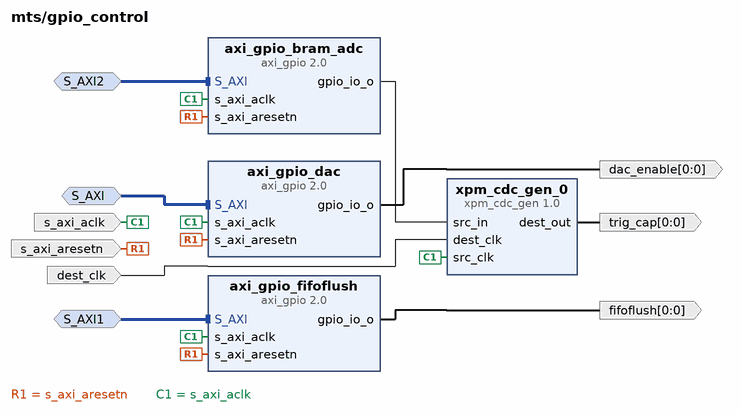
[diagram p2: block diagram inside /gpio_control]
create_bd_intf_pin -mode Slave -vlnv xilinx.com:interface:aximm_rtl:1.0 S_AXI
create_bd_intf_pin -mode Slave -vlnv xilinx.com:interface:aximm_rtl:1.0 S_AXI1
create_bd_intf_pin -mode Slave -vlnv xilinx.com:interface:aximm_rtl:1.0 S_AXI2
create_bd_pin -dir O -from 0 -to 0 dac_enable
create_bd_pin -dir I -type clk dest_clk
create_bd_pin -dir O -from 0 -to 0 fifoflush
create_bd_pin -dir I -type clk s_axi_aclk
create_bd_pin -dir I -type rst s_axi_aresetn
create_bd_pin -dir O -from 0 -to 0 trig_cap

create_bd_cell -type ip -vlnv xilinx.com:ip:axi_gpio:2.0 axi_gpio_bram_adc
set_property -dict {CONFIG.C_ALL_OUTPUTS 1 CONFIG.C_GPIO_WIDTH 1} [get_bd_cells axi_gpio_bram_adc]
create_bd_cell -type ip -vlnv xilinx.com:ip:axi_gpio:2.0 axi_gpio_dac
set_property -dict {CONFIG.C_ALL_OUTPUTS 1 CONFIG.C_GPIO_WIDTH 1} [get_bd_cells axi_gpio_dac]
create_bd_cell -type ip -vlnv xilinx.com:ip:axi_gpio:2.0 axi_gpio_fifoflush
set_property -dict {CONFIG.C_ALL_OUTPUTS 1 CONFIG.C_GPIO_WIDTH 1} [get_bd_cells axi_gpio_fifoflush]
create_bd_cell -type ip -vlnv xilinx.com:ip:xpm_cdc_gen:1.0 xpm_cdc_gen_0
set_property -dict [list \
  CONFIG.CDC_TYPE xpm_cdc_single \
  CONFIG.DEST_SYNC_FF 2 \
  CONFIG.INIT_SYNC_FF true \
  CONFIG.SRC_INPUT_REG false \
  CONFIG.WIDTH 1 \
] [get_bd_cells xpm_cdc_gen_0]

# ---- connections ----

current_bd_instance /clocktreeMTS
connect_bd_intf_net -intf_net control_interconnect_M07_AXI [get_bd_intf_pins s_axi_lite] [get_bd_intf_pins MTSclkwiz/s_axi_lite]
connect_bd_net -net BUFG_I_0_1 [get_bd_pins PL_CLK] [get_bd_pins BUFG_PL_CLK/BUFG_I]
connect_bd_net [get_bd_pins MTSclkwiz/interrupt] [get_bd_pins interrupt]
connect_bd_net [get_bd_pins PSreset_control/bus_struct_reset] [get_bd_pins bus_struct_reset]
connect_bd_net [get_bd_pins RFegressReset/peripheral_aresetn] [get_bd_pins egress_aresetn]
connect_bd_net [get_bd_pins RFingressReset/peripheral_aresetn] [get_bd_pins ingress_aresetn]
connect_bd_net -net clk_wiz_0_clk_out1 [get_bd_pins MTSclkwiz/clk_out1] \
  [get_bd_pins clkRF] [get_bd_pins RFingressReset/slowest_sync_clk] [get_bd_pins synchronizeSYSREF/dest_clk]
connect_bd_net -net clk_wiz_0_locked [get_bd_pins MTSclkwiz/locked] [get_bd_pins RFegressReset/dcm_locked] [get_bd_pins RFingressReset/dcm_locked]
connect_bd_net -net clk_wiz_adc0_clk_out2 [get_bd_pins MTSclkwiz/clk_out2] [get_bd_pins clkRFdiv2] [get_bd_pins RFegressReset/slowest_sync_clk]
connect_bd_net -net proc_sys_reset_0_peripheral_aresetn [get_bd_pins PSreset_control/peripheral_aresetn] \
  [get_bd_pins s_axi_aresetn] [get_bd_pins MTSclkwiz/s_axi_aresetn] [get_bd_pins RFingressReset/ext_reset_in]
connect_bd_net -net src_in_0_1 [get_bd_pins PL_SYSREF] [get_bd_pins synchronizeSYSREF/src_in]
connect_bd_net [get_bd_pins synchronizeSYSREF/dest_out] [get_bd_pins UserSYSREF]
connect_bd_net -net util_ds_buf_0_BUFG_O [get_bd_pins BUFG_PL_CLK/BUFG_O] [get_bd_pins MTSclkwiz/clk_in1] [get_bd_pins synchronizeSYSREF/src_clk]
connect_bd_net -net zynq_ultra_ps_e_0_pl_clk0 [get_bd_pins s_axi_aclk] \
  [get_bd_pins MTSclkwiz/ref_clk] [get_bd_pins MTSclkwiz/s_axi_aclk] [get_bd_pins PSreset_control/slowest_sync_clk]
connect_bd_net -net zynq_ultra_ps_e_0_pl_resetn0 [get_bd_pins ext_reset_in] \
  [get_bd_pins PSreset_control/ext_reset_in] [get_bd_pins RFegressReset/ext_reset_in]

current_bd_instance /gpio_control
connect_bd_intf_net -intf_net control_interconnect_M04_AXI [get_bd_intf_pins S_AXI] [get_bd_intf_pins axi_gpio_dac/S_AXI]
connect_bd_intf_net -intf_net control_interconnect_M05_AXI [get_bd_intf_pins S_AXI1] [get_bd_intf_pins axi_gpio_fifoflush/S_AXI]
connect_bd_intf_net -intf_net control_interconnect_M06_AXI [get_bd_intf_pins S_AXI2] [get_bd_intf_pins axi_gpio_bram_adc/S_AXI]
connect_bd_net -net axi_gpio_bram_cap_gpio_io_o [get_bd_pins axi_gpio_bram_adc/gpio_io_o] [get_bd_pins xpm_cdc_gen_0/src_in]
connect_bd_net [get_bd_pins axi_gpio_dac/gpio_io_o] [get_bd_pins dac_enable]
connect_bd_net -net axi_gpio_fifo_flush_gpio_io_o [get_bd_pins axi_gpio_fifoflush/gpio_io_o] [get_bd_pins fifoflush]
connect_bd_net [get_bd_pins dest_clk] [get_bd_pins xpm_cdc_gen_0/dest_clk]
connect_bd_net -net proc_sys_reset_0_peripheral_aresetn [get_bd_pins s_axi_aresetn] \
  [get_bd_pins axi_gpio_bram_adc/s_axi_aresetn] [get_bd_pins axi_gpio_dac/s_axi_aresetn] \
  [get_bd_pins axi_gpio_fifoflush/s_axi_aresetn]
connect_bd_net [get_bd_pins xpm_cdc_gen_0/dest_out] [get_bd_pins trig_cap]
connect_bd_net -net zynq_ultra_ps_e_0_pl_clk0 [get_bd_pins s_axi_aclk] \
  [get_bd_pins axi_gpio_bram_adc/s_axi_aclk] [get_bd_pins axi_gpio_dac/s_axi_aclk] \
  [get_bd_pins axi_gpio_fifoflush/s_axi_aclk] [get_bd_pins xpm_cdc_gen_0/src_clk]

current_bd_instance /
connect_bd_intf_net -intf_net S_AXI1_1 [get_bd_intf_pins control_interconnect/M04_AXI] [get_bd_intf_pins gpio_control/S_AXI1]
connect_bd_intf_net -intf_net S_AXI2_1 [get_bd_intf_pins control_interconnect/M05_AXI] [get_bd_intf_pins gpio_control/S_AXI2]
connect_bd_intf_net [get_bd_intf_pins control_interconnect/M03_AXI] [get_bd_intf_pins gpio_control/S_AXI]
connect_bd_intf_net -intf_net adc2_clk_0_1 [get_bd_intf_ports adc2_clk] [get_bd_intf_pins usp_rf_data_converter_1/adc2_clk]
connect_bd_intf_net [get_bd_intf_pins control_interconnect/M06_AXI] [get_bd_intf_pins system_management_wiz_0/S_AXI_LITE]
connect_bd_intf_net -intf_net dac2_clk_0_1 [get_bd_intf_ports dac2_clk] [get_bd_intf_pins usp_rf_data_converter_1/dac2_clk]
connect_bd_intf_net [get_bd_intf_pins control_interconnect/M00_AXI] [get_bd_intf_pins usp_rf_data_converter_1/s_axi]
connect_bd_intf_net [get_bd_intf_pins clocktreeMTS/s_axi_lite] [get_bd_intf_pins control_interconnect/M02_AXI]
connect_bd_intf_net -intf_net sysref_in_0_1 [get_bd_intf_ports sysref_in] [get_bd_intf_pins usp_rf_data_converter_1/sysref_in]
connect_bd_intf_net [get_bd_intf_ports vout00] [get_bd_intf_pins usp_rf_data_converter_1/vout00]
connect_bd_intf_net [get_bd_intf_ports vout10] [get_bd_intf_pins usp_rf_data_converter_1/vout10]
connect_bd_intf_net [get_bd_intf_ports vout20] [get_bd_intf_pins usp_rf_data_converter_1/vout20]
connect_bd_intf_net -intf_net vin0_01_0_1 [get_bd_intf_ports vin0_01] [get_bd_intf_pins usp_rf_data_converter_1/vin0_01]
connect_bd_intf_net -intf_net vin0_23_1_1 [get_bd_intf_ports vin0_23] [get_bd_intf_pins usp_rf_data_converter_1/vin0_23]
connect_bd_intf_net -intf_net vin1_01_0_1 [get_bd_intf_ports vin1_01] [get_bd_intf_pins usp_rf_data_converter_1/vin1_01]
connect_bd_intf_net -intf_net vin2_01_0_1 [get_bd_intf_ports vin2_01] [get_bd_intf_pins usp_rf_data_converter_1/vin2_01]
connect_bd_intf_net -intf_net vin2_23_0_1 [get_bd_intf_ports vin2_23] [get_bd_intf_pins usp_rf_data_converter_1/vin2_23]
connect_bd_intf_net [get_bd_intf_pins control_interconnect/S00_AXI] [get_bd_intf_pins zynq_ultra_ps_e_0/M_AXI_HPM0_LPD]
connect_bd_net -net BUFG_I_0_1 [get_bd_ports PL_CLK] [get_bd_pins clocktreeMTS/PL_CLK]
connect_bd_net [get_bd_pins IQ_product_0/gateway_out] [get_bd_pins ila_0/probe0]
connect_bd_net [get_bd_pins IQ_product_0/gateway_out1] [get_bd_pins ila_0/probe1]
connect_bd_net [get_bd_pins IQ_product_0/gateway_out2] [get_bd_pins ila_0/probe12]
connect_bd_net [get_bd_pins IQ_product_0/gateway_out3] [get_bd_pins ila_0/probe13]
connect_bd_net [get_bd_pins IQ_product_0/gateway_out4] [get_bd_pins ila_0/probe14]
connect_bd_net [get_bd_pins IQ_product_0/gateway_out5] [get_bd_pins ila_0/probe15]
connect_bd_net [get_bd_pins IQ_product_0/gateway_out6] [get_bd_pins ila_0/probe16]
connect_bd_net [get_bd_pins IQ_product_0/gateway_out7] [get_bd_pins ila_0/probe17]
connect_bd_net [get_bd_pins IQ_product_0/gateway_out8] [get_bd_pins ila_0/probe18]
connect_bd_net [get_bd_pins IQ_product_0/gateway_out9] [get_bd_pins ila_0/probe19]
connect_bd_net [get_bd_pins IQ_product_0/gateway_out10] [get_bd_pins ila_0/probe2]
connect_bd_net [get_bd_pins IQ_product_0/gateway_out11] [get_bd_pins ila_0/probe3]
connect_bd_net [get_bd_pins IQ_product_0/gateway_out12] [get_bd_pins ila_0/probe4]
connect_bd_net [get_bd_pins IQ_product_0/gateway_out13] [get_bd_pins ila_0/probe5]
connect_bd_net [get_bd_pins IQ_product_0/gateway_out14] [get_bd_pins ila_0/probe6]
connect_bd_net [get_bd_pins IQ_product_0/gateway_out15] [get_bd_pins ila_0/probe7]
connect_bd_net [get_bd_pins IQ_product_0/gateway_out16] [get_bd_pins ila_0/probe8]
connect_bd_net [get_bd_pins IQ_product_0/gateway_out17] [get_bd_pins ila_0/probe9]
connect_bd_net [get_bd_pins IQ_product_0/gateway_out18] [get_bd_pins ila_0/probe10]
connect_bd_net [get_bd_pins IQ_product_0/gateway_out19] [get_bd_pins ila_0/probe11]
connect_bd_net -net RFingressReset_peripheral_aresetn [get_bd_pins clocktreeMTS/ingress_aresetn] \
  [get_bd_pins usp_rf_data_converter_1/m0_axis_aresetn] [get_bd_pins usp_rf_data_converter_1/m1_axis_aresetn] \
  [get_bd_pins usp_rf_data_converter_1/m2_axis_aresetn] [get_bd_pins usp_rf_data_converter_1/m3_axis_aresetn] \
  [get_bd_pins usp_rf_data_converter_1/s0_axis_aresetn] [get_bd_pins usp_rf_data_converter_1/s1_axis_aresetn] \
  [get_bd_pins usp_rf_data_converter_1/s2_axis_aresetn] [get_bd_pins usp_rf_data_converter_1/s3_axis_aresetn]
connect_bd_net [get_bd_pins blk_mem_gen_1/douta] \
  [get_bd_pins usp_rf_data_converter_1/s00_axis_tdata] [get_bd_pins usp_rf_data_converter_1/s10_axis_tdata] \
  [get_bd_pins usp_rf_data_converter_1/s20_axis_tdata] [get_bd_pins usp_rf_data_converter_1/s30_axis_tdata]
connect_bd_net [get_bd_pins c_counter_binary_0/Q] [get_bd_pins blk_mem_gen_1/addra]
connect_bd_net -net clk_wiz_0_clk_out1 [get_bd_pins clocktreeMTS/clkRF] \
  [get_bd_pins usp_rf_data_converter_1/m0_axis_aclk] [get_bd_pins usp_rf_data_converter_1/m1_axis_aclk] \
  [get_bd_pins usp_rf_data_converter_1/m2_axis_aclk] [get_bd_pins usp_rf_data_converter_1/m3_axis_aclk] \
  [get_bd_pins usp_rf_data_converter_1/s0_axis_aclk] [get_bd_pins usp_rf_data_converter_1/s1_axis_aclk] \
  [get_bd_pins usp_rf_data_converter_1/s2_axis_aclk] [get_bd_pins usp_rf_data_converter_1/s3_axis_aclk] \
  [get_bd_pins IQ_product_0/clk] [get_bd_pins ila_0/clk] [get_bd_pins c_counter_binary_0/CLK] \
  [get_bd_pins blk_mem_gen_1/clka] [get_bd_pins vio_0/clk]
connect_bd_net -net clk_wiz_adc0_clk_out2 [get_bd_pins clocktreeMTS/clkRFdiv2] \
  [get_bd_pins gpio_control/dest_clk] [get_bd_pins zynq_ultra_ps_e_0/maxihpm1_fpd_aclk] \
  [get_bd_pins zynq_ultra_ps_e_0/maxihpm0_fpd_aclk]
connect_bd_net [get_bd_pins clocktreeMTS/interrupt] [get_bd_pins xlconcat_0/In2]
connect_bd_net -net proc_sys_reset_0_peripheral_aresetn [get_bd_pins clocktreeMTS/s_axi_aresetn] \
  [get_bd_pins control_interconnect/ARESETN] [get_bd_pins control_interconnect/M00_ARESETN] \
  [get_bd_pins control_interconnect/M01_ARESETN] [get_bd_pins control_interconnect/M02_ARESETN] \
  [get_bd_pins control_interconnect/M03_ARESETN] [get_bd_pins control_interconnect/M04_ARESETN] \
  [get_bd_pins control_interconnect/M05_ARESETN] [get_bd_pins control_interconnect/M06_ARESETN] \
  [get_bd_pins control_interconnect/S00_ARESETN] [get_bd_pins gpio_control/s_axi_aresetn] \
  [get_bd_pins system_management_wiz_0/s_axi_aresetn] [get_bd_pins usp_rf_data_converter_1/s_axi_aresetn]
connect_bd_net -net src_in_0_1 [get_bd_ports PL_SYSREF] [get_bd_pins clocktreeMTS/PL_SYSREF]
connect_bd_net -net synchronizeSYSREF_dest_out [get_bd_pins clocktreeMTS/UserSYSREF] \
  [get_bd_pins usp_rf_data_converter_1/user_sysref_dac] [get_bd_pins usp_rf_data_converter_1/user_sysref_adc]
connect_bd_net [get_bd_pins system_management_wiz_0/ip2intc_irpt] [get_bd_pins xlconcat_0/In3]
connect_bd_net [get_bd_pins usp_rf_data_converter_1/irq] [get_bd_pins xlconcat_0/In1]
connect_bd_net [get_bd_pins usp_rf_data_converter_1/m00_axis_tdata] [get_bd_pins IQ_product_0/i1] [get_bd_pins ila_0/probe20]
connect_bd_net [get_bd_pins usp_rf_data_converter_1/m01_axis_tdata] [get_bd_pins IQ_product_0/q1] [get_bd_pins ila_0/probe21]
connect_bd_net [get_bd_pins usp_rf_data_converter_1/m02_axis_tdata] [get_bd_pins IQ_product_0/i2] [get_bd_pins ila_0/probe22]
connect_bd_net [get_bd_pins usp_rf_data_converter_1/m03_axis_tdata] [get_bd_pins IQ_product_0/q2] [get_bd_pins ila_0/probe23]
connect_bd_net [get_bd_pins usp_rf_data_converter_1/m20_axis_tdata] [get_bd_pins IQ_product_0/i3] [get_bd_pins ila_0/probe24]
connect_bd_net [get_bd_pins usp_rf_data_converter_1/m21_axis_tdata] [get_bd_pins IQ_product_0/q3] [get_bd_pins ila_0/probe25]
connect_bd_net [get_bd_pins usp_rf_data_converter_1/m22_axis_tdata] [get_bd_pins IQ_product_0/i4] [get_bd_pins ila_0/probe26]
connect_bd_net [get_bd_pins usp_rf_data_converter_1/m23_axis_tdata] [get_bd_pins IQ_product_0/q4] [get_bd_pins ila_0/probe27]
connect_bd_net [get_bd_pins vio_0/probe_out0] [get_bd_pins blk_mem_gen_1/ena]
connect_bd_net [get_bd_pins vio_0/probe_out1] \
  [get_bd_pins usp_rf_data_converter_1/s00_axis_tvalid] [get_bd_pins usp_rf_data_converter_1/s10_axis_tvalid] \
  [get_bd_pins usp_rf_data_converter_1/s20_axis_tvalid] [get_bd_pins usp_rf_data_converter_1/s30_axis_tvalid]
connect_bd_net [get_bd_pins xlconcat_0/dout] [get_bd_pins zynq_ultra_ps_e_0/pl_ps_irq0]
connect_bd_net [get_bd_pins zynq_ultra_ps_e_0/pl_clk0] \
  [get_bd_pins clocktreeMTS/s_axi_aclk] [get_bd_pins control_interconnect/ACLK] [get_bd_pins control_interconnect/M00_ACLK] \
  [get_bd_pins control_interconnect/M01_ACLK] [get_bd_pins control_interconnect/M02_ACLK] \
  [get_bd_pins control_interconnect/M03_ACLK] [get_bd_pins control_interconnect/M04_ACLK] \
  [get_bd_pins control_interconnect/M05_ACLK] [get_bd_pins control_interconnect/M06_ACLK] \
  [get_bd_pins control_interconnect/S00_ACLK] [get_bd_pins gpio_control/s_axi_aclk] \
  [get_bd_pins system_management_wiz_0/s_axi_aclk] [get_bd_pins usp_rf_data_converter_1/s_axi_aclk] \
  [get_bd_pins zynq_ultra_ps_e_0/maxihpm0_lpd_aclk]
connect_bd_net [get_bd_pins zynq_ultra_ps_e_0/pl_resetn0] [get_bd_pins clocktreeMTS/ext_reset_in]

# ---- address map ----
assign_bd_address -offset 0x0080000000 -range 64K -target_address_space [get_bd_addr_spaces zynq_ultra_ps_e_0/Data] [get_bd_addr_segs clocktreeMTS/MTSclkwiz/s_axi_lite/Reg]
assign_bd_address -offset 0x0080020000 -range 64K -target_address_space [get_bd_addr_spaces zynq_ultra_ps_e_0/Data] [get_bd_addr_segs gpio_control/axi_gpio_bram_adc/S_AXI/Reg]
assign_bd_address -offset 0x0080030000 -range 64K -target_address_space [get_bd_addr_spaces zynq_ultra_ps_e_0/Data] [get_bd_addr_segs gpio_control/axi_gpio_dac/S_AXI/Reg]
assign_bd_address -offset 0x0080040000 -range 64K -target_address_space [get_bd_addr_spaces zynq_ultra_ps_e_0/Data] [get_bd_addr_segs gpio_control/axi_gpio_fifoflush/S_AXI/Reg]
assign_bd_address -offset 0x0080050000 -range 64K -target_address_space [get_bd_addr_spaces zynq_ultra_ps_e_0/Data] [get_bd_addr_segs system_management_wiz_0/S_AXI_LITE/Reg]
assign_bd_address -offset 0x0080080000 -range 256K -target_address_space [get_bd_addr_spaces zynq_ultra_ps_e_0/Data] [get_bd_addr_segs usp_rf_data_converter_1/s_axi/Reg]

validate_bd_design
save_bd_design
